# Altium schematic sheet 3_电子天平_加密芯片.SchDoc: 电子天平_加密芯片
size A4; Date: 2020/01/07; ApprovedBy: Riggin; CheckedBy: Riggin; Author: Riggin; DrawnBy: Riggin; Engineer: Riggin; DocumentNumber: 4; Revision: V1.0; SheetNumber: 4; SheetTotal: 8; Time: 14:09:34; ProjectName: 电子天平
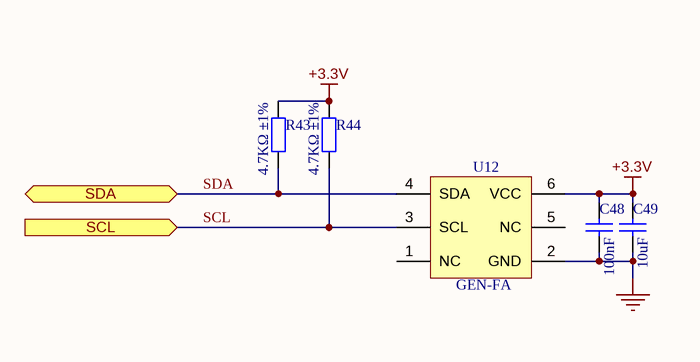
[diagram p0: 3_电子天平_加密芯片.SchDoc]

## Parts
C48  100nF  [LC-0805_C]
C49  10uF  [LC-0805_C]
R43  4.7KΩ ±1%  [LC-0805_R]
R44  4.7KΩ ±1%  [LC-0805_R]
U12  GEN-FA  [LC-SOT-23-6]

## Ports
SCL (in), SDA (bidir)

## Nets
+3.3V: C48.1 C49.1 R43.1 R44.1 U12.6(VCC)
GND: C48.2 C49.2 U12.2(GND)
SCL: R44.2 U12.3(SCL) ; port SCL
SDA: R43.2 U12.4(SDA) ; port SDA

Not connected (* = marked no-connect by the designer): U12 1(NC) 5(NC)

## Notes on the sheet
- Title
- Company:
- Address:
- 广东省广州市
- DZT Studio
- Size:
- Date:
- Drawn By:
- A4
- Riggin
- Time:
- Revision:
- Approved By:
- Sheet
- of
- Email:
- RigginLi@icloud.com
- Project:

## Library data of the parts
C48 C49 = Cap: MLCC; Value: 100pF; Published: 8-Jun-2000; LatestRevisionDate: 17-Jul-2002; LatestRevisionNote: Re-released for DXP Platform.; PackageReference: RAD-0.3; Publisher: Altium Limited; PackageDescription: Radial Cap, Thru-Hole; 2 Leads; 0.3 in Pin Spacing
R43 R44 = Res2: Resistor; Value: 1K; Published: 8-Jun-2000; LatestRevisionDate: 17-Jul-2002; LatestRevisionNote: Re-released for DXP Platform.; PackageReference: AXIAL-0.4; Publisher: Altium Limited; PackageDescription: Axial Device, Thru-Hole; 2 Leads; 0.4 in Pin Spacing
U12 = ALPU-FA: neowine加密芯片  带32Kbits EEPROM。